# Altium schematic sheet 10.AS5047 Encoder.SchDoc
size 297 x 209 mm
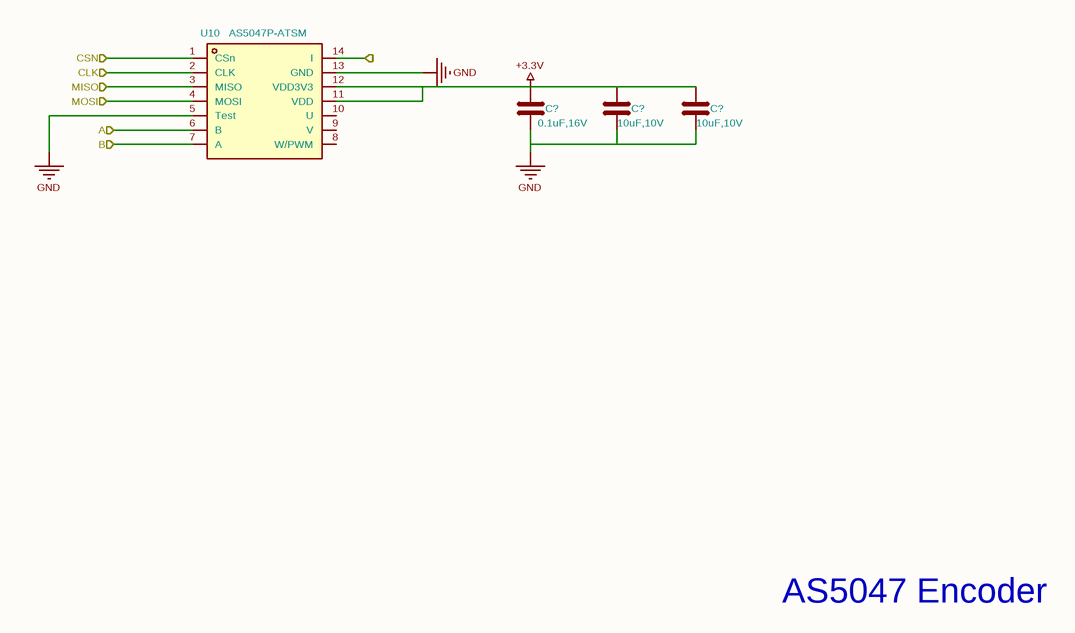
[diagram p0: 10.AS5047 Encoder.SchDoc]

## Parts
(Parts that share a designator on the sheet are numbered #1, #2 ... from top to bottom, then left to right.)
C?#1  0.1uF,16V  [C_0402]
C?#2  10uF,10V  [C_0402]
C?#3  10uF,10V  [C_0402]
U10  AS5047P-ATSM  [TSSOP-14_L5.0-W4.4-P0.65-LS6.4-BL]

## Ports
A (in), B (in), CLK (in), CSN (in), I (in), MISO (in), MOSI (in)

## Nets
+3.3V: C?#1.1 C?#2.1 C?#3.1 U10.11(VDD) U10.12(VDD3V3)
GND: C?#1.2 C?#2.2 C?#3.2 U10.5(Test) U10.13(GND)
A: U10.6(B) ; port A
B: U10.7(A) ; port B
CLK: U10.2(CLK) ; port CLK
CSN: U10.1(CSn) ; port CSN
I: U10.14(I) ; port I
MISO: U10.3(MISO) ; port MISO
MOSI: U10.4(MOSI) ; port MOSI

Not connected (* = marked no-connect by the designer): U10 8(W/PWM) 9(V) 10(U)

## Notes on the sheet
- AS5047 Encoder
- 1
- 2
- 3
- 4
- 5
- 6
- A
- B
- C
- D
- Title: HPM6E8Y_RbMotor_ECAT
- File: 10.AS5047 Encoder.kicad_sch
- Sheet: /
- KiCad E.D.A.  kicad (5.1.4)-1
- Size: A4
- Date:
- Rev: RevB+
- Id: 1/1

## Library data of the parts
C?#1 = 0.1uF,16V_0402_1: Model: CL05B104KO5NNNC; Company: SAMSUNG(三星); Value: 0.1uF,16V; Footprint: 03_HPM_Capacitance:C_0402
C?#2 C?#3 = 10uF,10V_0402: Model: CL05A106MP5NUNC; Company: SAMSUNG(三星); Value: 10uF,10V; Footprint: 03_HPM_Capacitance:C_0402
U10 = AS5047P-ATSM: Company: ams(艾迈斯半导体); SuppliersPartNumber: C962063; Model: AS5047P-ATSM; Value: AS5047P-ATSM; Footprint: 06_HPM_SO:TSSOP-14_L5.0-W4.4-P0.65-LS6.4-BL